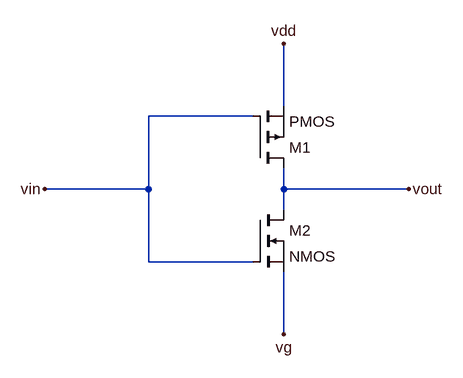
[diagram p0: schematic inverter.asc]
inverter.asc, the LTspice schematic file:
Version 4
SHEET 1 880 680
WIRE 208 -560 208 -656
WIRE 160 -544 0 -544
WIRE 0 -432 0 -544
WIRE 0 -432 -160 -432
WIRE 208 -432 208 -464
WIRE 400 -432 208 -432
WIRE 208 -400 208 -432
WIRE 0 -320 0 -432
WIRE 160 -320 0 -320
WIRE 208 -208 208 -304
FLAG -160 -432 vin
FLAG 208 -656 vdd
FLAG 400 -432 vout
FLAG 208 -208 vg
SYMBOL pmos 160 -464 M180
SYMATTR InstName M1
SYMBOL nmos 160 -400 R0
SYMATTR InstName M2

The netlist it stands for:
* inverter.asc
M1 vout vin vdd vdd PMOS
M2 vout vin vg vg NMOS
.model NMOS NMOS
.model PMOS PMOS
.lib standard.mos
.backanno
.end